# EAGLE schematic Power Board rev0.1 manufactured 2016-10-04 (EAGLE 7.6.0)
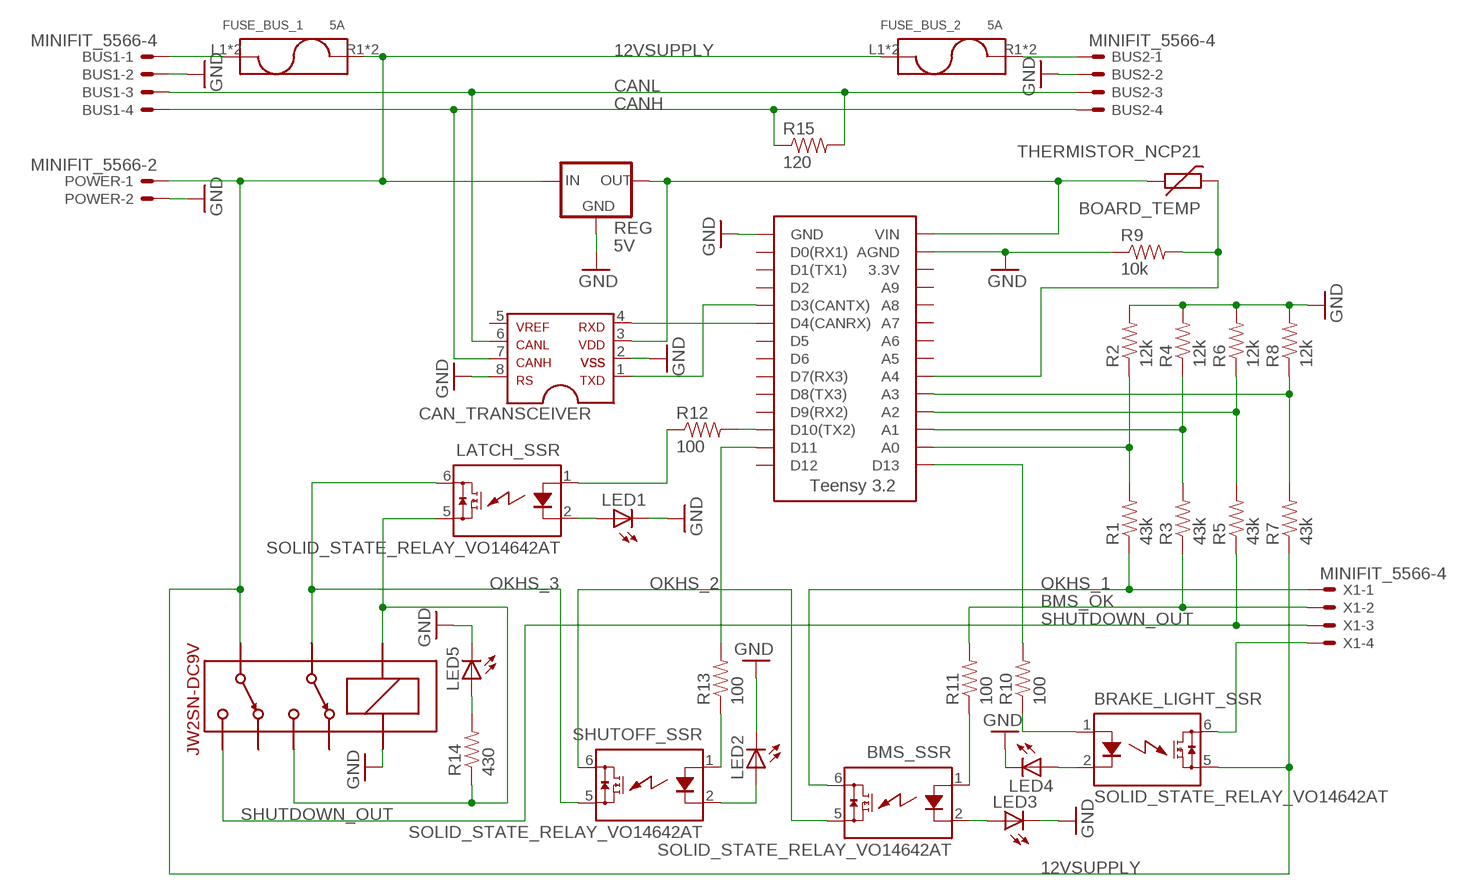
[diagram p0: schematic, sheet 1]

## Parts
BMS_SSR  SOLID_STATE_RELAY_VO14642AT  [DIL06]
BOARD_TEMP  THERMISTOR_NCP21  [0805]
BRAKE_LIGHT_SSR  SOLID_STATE_RELAY_VO14642AT  [DIL06]
BUS1  MINIFIT_5566-4  [MINIFIT_5566-4]
BUS2  MINIFIT_5566-4  [MINIFIT_5566-4]
CAN_TRANSCEIVER  MCP2551DIL  [DIL08]
FUSE_BUS_1  5A  FUSE_HOLDER  [FUSE_HOLDER]
FUSE_BUS_2  5A  FUSE_HOLDER  [FUSE_HOLDER]
IMD_SHUTDOWN  DPDT_RELAY_PANASONIC_JW2SN-DC9V  [DPDT_RELAY_PANASONIC_JW2SN]
LATCH_SSR  SOLID_STATE_RELAY_VO14642AT  [DIL06]
LED1  LED-0805  [LED-805]
LED2  LED-0805  [LED-805]
LED3  LED-0805  [LED-805]
LED4  LED-0805  [LED-805]
LED5  LED-0805  [LED-805]
POWER  MINIFIT_5566-2  [MINIFIT_5566-2]
R1  43k  RESISTOR0805-RES  [0805]
R2  12k  RESISTOR0805-RES  [0805]
R3  43k  RESISTOR0805-RES  [0805]
R4  12k  RESISTOR0805-RES  [0805]
R5  43k  RESISTOR0805-RES  [0805]
R6  12k  RESISTOR0805-RES  [0805]
R7  43k  RESISTOR0805-RES  [0805]
R8  12k  RESISTOR0805-RES  [0805]
R9  10k  RESISTOR0805-RES  [0805]
R10  100  RESISTOR0805-RES  [0805]
R11  100  RESISTOR0805-RES  [0805]
R12  100  RESISTOR0805-RES  [0805]
R13  100  RESISTOR0805-RES  [0805]
R14  430  RESISTOR0805-RES  [0805]
R15  120  RESISTOR0805-RES  [0805]
REG  5V  5V_REGULATOR_LM340-NLM340MPX-5.0/NOPB  [SOT223]
SHUTOFF_SSR  SOLID_STATE_RELAY_VO14642AT  [DIL06]
U$3  TEENSY_3.2_SIMPLE  [TEENSY_3.2_SIMPLE]
X1  MINIFIT_5566-4  [MINIFIT_5566-4]

## Nets
5VSUPPLY: BOARD_TEMP.1 CAN_TRANSCEIVER.3 REG.3(OUT) U$3.VIN
12VSUPPLY: BRAKE_LIGHT_SSR.5(IO2) FUSE_BUS_1.R1 FUSE_BUS_1.R2 FUSE_BUS_2.L1 FUSE_BUS_2.L2 IMD_SHUTDOWN.6 POWER.1 R7.1 REG.1(IN)
12VSUPPLY_READ: R7.2 R8.1 U$3.A3
BMS_OK: R3.1 R11.2 X1.2
BMS_OK_READ: R3.2 R4.1 U$3.A1
CANH: BUS1.4 BUS2.4 CAN_TRANSCEIVER.7 R15.1
CANL: BUS1.3 BUS2.3 CAN_TRANSCEIVER.6 R15.2
GND: BUS1.2 BUS2.2 CAN_TRANSCEIVER.2 CAN_TRANSCEIVER.8 IMD_SHUTDOWN.COIL+ LED1.C LED2.C LED3.C LED4.C LED5.C POWER.2 R2.2 R4.2 R6.2 R8.2 R9.1 REG.2(GND) REG.4(GND) U$3.AGND U$3.GND
N$1: LATCH_SSR.2(LED-) LED1.A
N$2: CAN_TRANSCEIVER.4 U$3.D4(CANRX)
N$3: CAN_TRANSCEIVER.1 U$3.D3(CANTX)
N$4: BRAKE_LIGHT_SSR.6(IO1) X1.4
N$5: R12.2 U$3.D10(TX2)
N$6: IMD_SHUTDOWN.4 IMD_SHUTDOWN.COIL- LATCH_SSR.5(IO2) R14.1
N$7: BRAKE_LIGHT_SSR.2(LED-) LED4.A
N$8: LATCH_SSR.1(LED+) R12.1
N$9: BMS_SSR.2(LED-) LED3.A
N$10: BUS1.1 FUSE_BUS_1.L1 FUSE_BUS_1.L2
N$11: BUS2.1 FUSE_BUS_2.R1 FUSE_BUS_2.R2
N$12: R13.1 SHUTOFF_SSR.1(LED+)
N$13: R10.2 U$3.D13
N$14: R13.2 U$3.D11
N$15: BOARD_TEMP.2 R9.2 U$3.A4
N$16: LED2.A SHUTOFF_SSR.2(LED-)
N$17: BRAKE_LIGHT_SSR.1(LED+) R10.1
N$18: BMS_SSR.1(LED+) R11.1
N$19: LED5.A R14.2
OKHS_1: BMS_SSR.6(IO1) R1.1 X1.1
OKHS_2: BMS_SSR.5(IO2) SHUTOFF_SSR.6(IO1)
OKHS_3: IMD_SHUTDOWN.3 LATCH_SSR.6(IO1) SHUTOFF_SSR.5(IO2)
OKHS_READ: R1.2 R2.1 U$3.A0
SHUTDOWN_OUT: IMD_SHUTDOWN.5 R5.1 X1.3
SHUTDOWN_OUT_READ: R5.2 R6.1 U$3.A2
Unconnected: CAN_TRANSCEIVER.5 IMD_SHUTDOWN.2 IMD_SHUTDOWN.7 U$3.3.3V U$3.A5 U$3.A6 U$3.A7 U$3.A8 U$3.A9 U$3.D0(RX1) U$3.D1(TX1) U$3.D2 U$3.D5 U$3.D6 U$3.D7(RX3) U$3.D8(TX3) U$3.D9(RX2) U$3.D12

## Library data of the parts
BMS_SSR BRAKE_LIGHT_SSR LATCH_SSR SHUTOFF_SSR = HyTechDevices:SOLID_STATE_RELAY
BOARD_TEMP = HyTechDevices:THERMISTOR_NCP21: Murata NCP21 10k Thermistor Datasheet <http://www.murata.com/~/media/webrenewal/support/library/catalog/products/thermistor/ntc/r44e.ashx>
BUS1 BUS2 X1 = HyTechDevices:MINIFIT_5566-4: Mini FIT Junior connector 4 pole Source: http://www.molex.com; OC_FARNELL: unknown; OC_NEWARK: unknown
CAN_TRANSCEIVER = HyTechDevices:MCP2551: MCP2551 High-Speed CAN Transceiver Product Webpage <https://www.microchip.com/wwwproducts/en/MCP2551> Datasheet <http://ww1.microchip.com/downloads/en/DeviceDoc/21667f.pdf> This device is outdated It is replaced by MCP2561. Comparison Page <https://www.microchip.com/wwwproducts/ProductCompare/MCP2551/MCP2561> Product Webpage <https://www.microchip.com/wwwproducts/en/MCP2561> Datasheet <http://ww1.microchip.com/downloads/en/DeviceDoc/20005167C.pdf>
FUSE_BUS_1 FUSE_BUS_2 = HyTechDevices:FUSE_HOLDER: Keystone Electronics 3568 Fuse Mouser Part <http://www.mouser.com/ProductDetail/Keystone-Electronics/3568> Datasheet <http://www.mouser.com/ds/2/215/568-742601.pdf>
IMD_SHUTDOWN = HyTechDevices:DPDT_RELAY_PANASONIC_JW2SN-DC9V: Double Pull Double Throw Relay 9VDC Datasheet <http://www.mouser.com/ds/2/316/jw-catalog-461998.pdf> Product Page <http://www.mouser.com/ProductDetail/Panasonic-Industrial-Devices/JW2SN-DC9V>
LED1-LED5 = HyTechDevices:LED: Light Emitting Diode Source: Dangerous Prototypes Eagle Library <https://github.com/DangerousPrototypes/Eagle_Part_Library>
POWER = HyTechDevices:MINIFIT_5566-2: Mini FIT Junior connector 2 pole Source: http://www.molex.com; OC_FARNELL: 1822072; OC_NEWARK: unknown
R1-R15 = HyTechDevices:RESISTOR: Resistor Basic schematic elements and footprints for 0603, 1206, and PTH resistors.
REG = HyTechDevices:5V_REGULATOR_LM340-N: Voltage Regulator 5v linear voltage regulator Datasheet <http://www.mouser.com/ProductDetail/Texas-Instruments/LM340MPX-50-NOPB/?qs=X1J7HmVL2ZGZwtTFRQ9ItA%3D%3D> MAX current out: 1.5A MAX voltage in: 35V
U$3 = HyTechDevices:TEENSY_3.2_SIMPLE: Simple version of the Teensy 3.2 board that only uses the 2 main rows of pins, not the inner pins or the pins opposite the usb port.